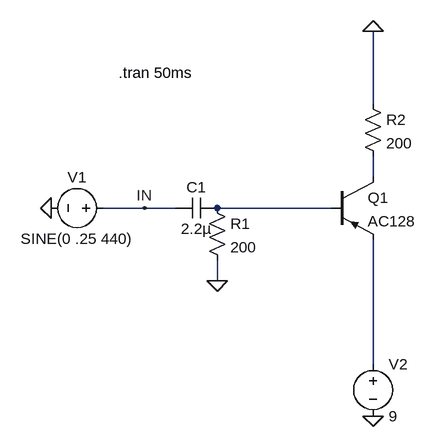
[diagram p0: schematic fuzz-face.asc]
fuzz-face.asc, the LTspice schematic file:
Version 4
SHEET 1 880 680
WIRE 528 64 528 -48
WIRE 528 176 528 144
WIRE 176 224 112 224
WIRE 224 224 176 224
WIRE 464 224 288 224
WIRE 288 336 288 304
WIRE 528 464 528 272
FLAG 32 224 0
FLAG 176 224 IN
FLAG 288 336 0
FLAG 528 544 0
FLAG 528 -48 0
SYMBOL voltage 128 224 R90
WINDOW 0 -32 56 VBottom 2
WINDOW 3 32 56 VTop 2
SYMATTR InstName V1
SYMATTR Value SINE(0 .25 440)
SYMBOL cap 288 208 R90
WINDOW 0 0 32 VBottom 2
WINDOW 3 32 32 VTop 2
SYMATTR InstName C1
SYMATTR Value 2.2µ
SYMBOL res 272 208 R0
SYMATTR InstName R1
SYMATTR Value 200
SYMBOL pnp 464 176 R0
SYMATTR InstName Q1
SYMATTR Value AC128
SYMBOL voltage 528 448 R0
SYMATTR InstName V2
SYMATTR Value 9
SYMBOL res 512 48 R0
SYMATTR InstName R2
SYMATTR Value 200
TEXT 136 16 Left 2 !.tran 50ms

The netlist it stands for:
* fuzz-face.asc
V1 IN 0 SINE(0 .25 440)
C1 N002 IN 2.2µ
R1 N002 0 200
Q1 N001 N002 N003 0 AC128
V2 N003 0 9
R2 0 N001 200
.model NPN NPN
.model PNP PNP
.lib standard.bjt
.tran 50ms
.backanno
.end